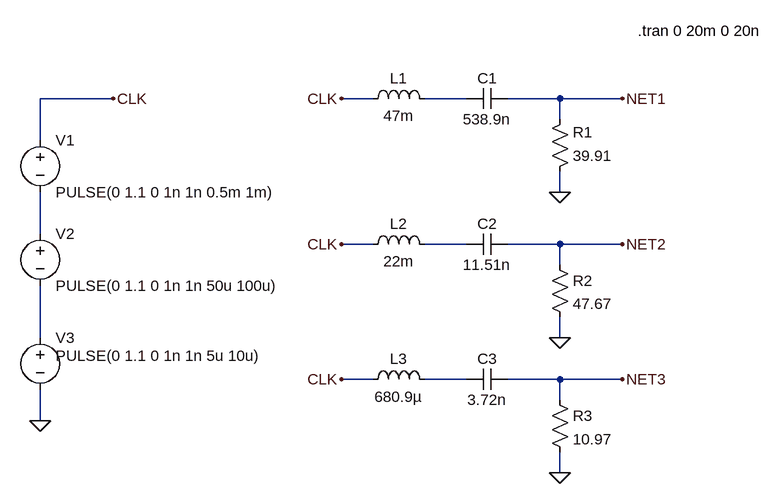
[diagram p0: schematic Lab2.asc]
Lab2.asc, the LTspice schematic file:
Version 4
SHEET 1 880 680
WIRE -1568 -432 -1680 -432
WIRE -1168 -432 -1216 -432
WIRE -1024 -432 -1088 -432
WIRE -880 -432 -960 -432
WIRE -784 -432 -880 -432
WIRE -880 -400 -880 -432
WIRE -1680 -368 -1680 -432
WIRE -880 -288 -880 -320
WIRE -1680 -224 -1680 -288
WIRE -1168 -208 -1216 -208
WIRE -1024 -208 -1088 -208
WIRE -880 -208 -960 -208
WIRE -784 -208 -880 -208
WIRE -880 -176 -880 -208
WIRE -1680 -64 -1680 -144
WIRE -880 -64 -880 -96
WIRE -1168 0 -1216 0
WIRE -1024 0 -1088 0
WIRE -880 0 -960 0
WIRE -784 0 -880 0
WIRE -880 32 -880 0
WIRE -1680 64 -1680 16
WIRE -880 144 -880 112
FLAG -1680 64 0
FLAG -1568 -432 CLK
FLAG -880 -288 0
FLAG -1216 -432 CLK
FLAG -784 -432 NET1
FLAG -880 -64 0
FLAG -1216 -208 CLK
FLAG -784 -208 NET2
FLAG -880 144 0
FLAG -1216 0 CLK
FLAG -784 0 NET3
SYMBOL voltage -1680 -384 R0
WINDOW 123 0 0 Left 0
WINDOW 39 0 0 Left 0
SYMATTR InstName V1
SYMATTR Value PULSE(0 1.1 0 1n 1n 0.5m 1m)
SYMBOL voltage -1680 -240 R0
WINDOW 123 0 0 Left 0
WINDOW 39 0 0 Left 0
SYMATTR InstName V2
SYMATTR Value PULSE(0 1.1 0 1n 1n 50u 100u)
SYMBOL voltage -1680 -80 R0
WINDOW 3 24 44 Left 2
WINDOW 123 0 0 Left 0
WINDOW 39 0 0 Left 0
SYMATTR Value PULSE(0 1.1 0 1n 1n 5u 10u)
SYMATTR InstName V3
SYMBOL res -896 -304 M180
WINDOW 0 36 76 Left 2
WINDOW 3 36 40 Left 2
SYMATTR InstName R1
SYMATTR Value 39.91
SYMBOL ind -1184 -416 R270
WINDOW 0 32 56 VTop 2
WINDOW 3 5 56 VBottom 2
SYMATTR InstName L1
SYMATTR Value 47m
SYMBOL cap -960 -448 R90
WINDOW 0 0 32 VBottom 2
WINDOW 3 32 32 VTop 2
SYMATTR InstName C1
SYMATTR Value 538.9n
SYMBOL res -896 -192 R0
SYMATTR InstName R2
SYMATTR Value 47.67
SYMBOL ind -1184 -192 R270
WINDOW 0 32 56 VTop 2
WINDOW 3 5 56 VBottom 2
SYMATTR InstName L2
SYMATTR Value 22m
SYMBOL cap -960 -224 R90
WINDOW 0 0 32 VBottom 2
WINDOW 3 32 32 VTop 2
SYMATTR InstName C2
SYMATTR Value 11.51n
SYMBOL res -896 16 R0
SYMATTR InstName R3
SYMATTR Value 10.97
SYMBOL ind -1184 16 R270
WINDOW 0 32 56 VTop 2
WINDOW 3 5 56 VBottom 2
SYMATTR InstName L3
SYMATTR Value 680.9µ
SYMBOL cap -960 -16 R90
WINDOW 0 0 32 VBottom 2
WINDOW 3 32 32 VTop 2
SYMATTR InstName C3
SYMATTR Value 3.72n
TEXT -760 -536 Left 2 !.tran 0 20m 0 20n

The netlist it stands for:
* Lab2.asc
V1 CLK N002 PULSE(0 1.1 0 1n 1n 0.5m 1m)
V2 N002 N004 PULSE(0 1.1 0 1n 1n 50u 100u)
V3 N004 0 PULSE(0 1.1 0 1n 1n 5u 10u)
R1 0 NET1 39.91
L1 CLK N001 47m
C1 NET1 N001 538.9n
R2 NET2 0 47.67
L2 CLK N003 22m
C2 NET2 N003 11.51n
R3 NET3 0 10.97
L3 CLK N005 680.9µ
C3 NET3 N005 3.72n
.tran 0 20m 0 20n
.backanno
.end

* Results of the author's LTspice run, read from the files saved beside the schematic
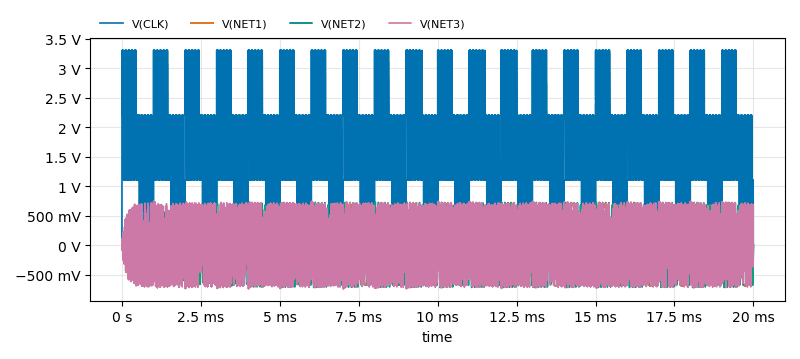
[diagram p1: Transient Analysis of Lab2.asc, plotted from the saved traces]
* Transient Analysis, 1 run:
*   V(CLK): min 0 V, max 3.3 V, average 1.65 V, rms 1.905 V, last 0 V
*   V(NET1): min -695.8 mV, max 710.7 mV, average -3.799 mV, rms 461.2 mV, last -36.12 mV
*   V(NET2): min -720 mV, max 726.5 mV, average -516 µV, rms 478.6 mV, last -2.439 mV
*   V(NET3): min -742.2 mV, max 743.9 mV, average -50.2 µV, rms 492.8 mV, last -4.701 mV